# Altium schematic sheet CPU.SchDoc
size A4; SheetNumber: 4; SheetTotal: 5; SPICEModelCacheQSXZYONQ: <root> / <DocumentId>QSXZYONQ</DocumentId> / <CacheFrame Number="0"> / <Model Name="1n4148" Kind="MDL"> / <Text>.model 1N4148  D(Is=0.1p Rs=16 CJO=2p Tt=12n Bv=100 Ibv=0.1p)</Text> / </Model> / </CacheFrame> / </root>
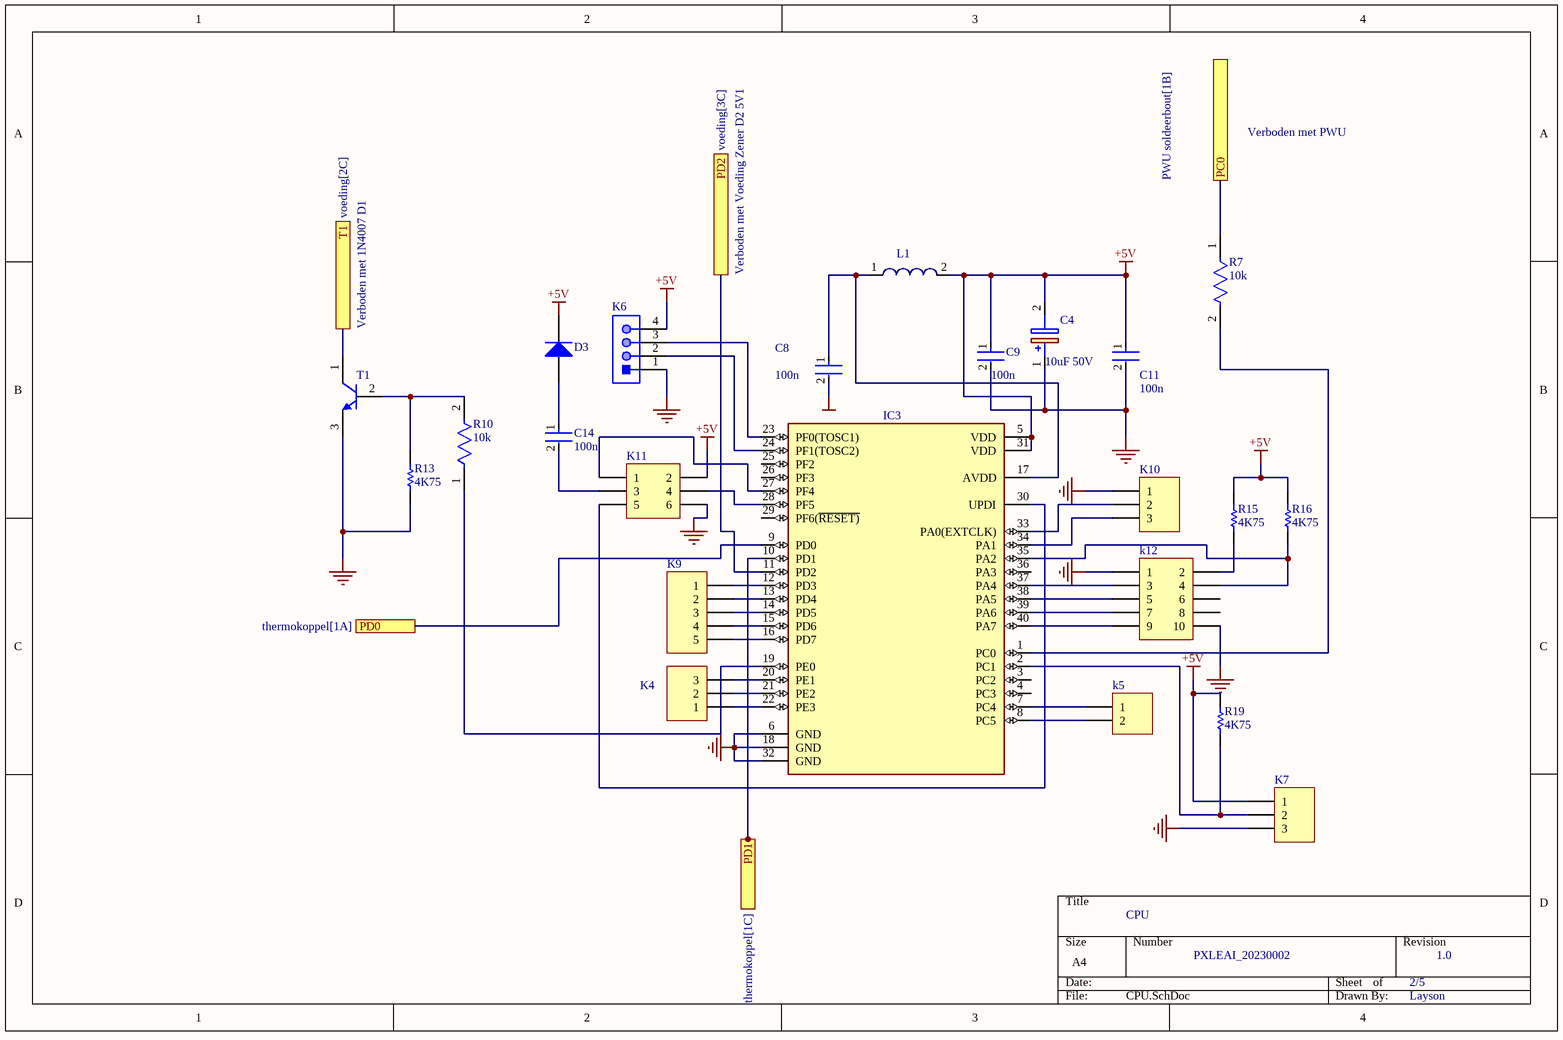
[diagram p0: CPU.SchDoc]

## Parts
C4  10uF 50V  [CAPPRD200W52D525H1200]
C8  100n  [FP-C0402-BB-MFG]
C9  100n  [FP-C0402-BB-MFG]
C11  100n  [FP-C0402-BB-MFG]
C14  100n  [FP-C0402-BB-MFG]
D3  Diode 1N4148  [DO-35]  (value not drawn)
IC3  ATMEGA4809-PF  [FP-C04-016-MFG]  (value not drawn)
K4  Header 3  [HDR1X3]  (value not drawn)
k5  Header 2  [HDR1X2]  (value not drawn)
K6  66200411122  [66200411122]  (value not drawn)
K7  Header 3  [HDR1X3]  (value not drawn)
K9  Header 5  [HDR1X5]  (value not drawn)
K10  Header 3  [HDR1X3]  (value not drawn)
K11  MHDR2X3  [MHDR2X3]  (value not drawn)
k12  Header 5X2  [HDR2X5]  (value not drawn)
L1  760308201  [3737]  (value not drawn)
R7  10k  [FP-MBB0207-MFG]
R10  10k  [FP-MBB0207-MFG]
R13  4K75  [RESA60-630X240]
R15  4K75  [RESA60-630X240]
R16  4K75  [RESA60-630X240]
R19  4K75  [RESA60-630X240]
T1  BC547CZL1G  [ONSC-TO-92-3-29-11_AM_BL]  (value not drawn)

## Ports
PC0 (see PWU soldeerbout[1B]), PD0 (see thermokoppel[1A]), PD1 (see thermokoppel[1C]), PD2 (see voeding[3C]), T1 (see voeding[2C])

## Nets
+5V: C4.2(-) C9.1 C11.1 D3.2(K) IC3.5(VDD) IC3.31(VDD) K6.4 K7.1 K11.2 L1.2 R15.2 R16.2 R19.2
GND: C4.1(+) C8.2 C9.2 C11.2 IC3.6(GND) IC3.18(GND) IC3.32(GND) K6.1 K7.3 K10.1 K11.6 k12.1 k12.10 R13.1 T1.3(E)
PC0: R7.1 ; port PC0
PD0: IC3.9(PD0) ; port PD0
PD1: IC3.10(PD1) ; port PD1
PD2: IC3.11(PD2) ; port PD2
T1: T1.1(C) ; port T1
NetC8_1: C8.1 IC3.17(AVDD) L1.1
NetC14_1: C14.1 D3.1(A)
NetC14_2: C14.2 K11.3
NetIC3_1: IC3.1(PC0) R7.2
NetIC3_2: IC3.2(PC1) K7.2 R19.1
NetIC3_7: IC3.7(PC4) k5.1
NetIC3_8: IC3.8(PC5) k5.2
NetIC3_12: IC3.12(PD3) K9.1
NetIC3_13: IC3.13(PD4) K9.2
NetIC3_14: IC3.14(PD5) K9.3
NetIC3_15: IC3.15(PD6) K9.4
NetIC3_16: IC3.16(PD7) K9.5
NetIC3_19: IC3.19(PE0) R10.1
NetIC3_20: IC3.20(PE1) K4.3
NetIC3_21: IC3.21(PE2) K4.2
NetIC3_22: IC3.22(PE3) K4.1
NetIC3_23: IC3.23(PF0(TOSC1)) K6.3
NetIC3_24: IC3.24(PF1(TOSC2)) K6.2
NetIC3_27: IC3.27(PF4) K11.1
NetIC3_28: IC3.28(PF5) K11.4
NetIC3_30: IC3.30(UPDI) K11.5
NetIC3_33: IC3.33(PA0(EXTCLK)) K10.2
NetIC3_34: IC3.34(PA1) K10.3
NetIC3_35: IC3.35(PA2) k12.4 R16.1
NetIC3_37: IC3.37(PA4) k12.3
NetIC3_38: IC3.38(PA5) k12.5
NetIC3_39: IC3.39(PA6) k12.7
NetIC3_40: IC3.40(PA7) k12.9
Netk12_2: k12.2 R15.1
NetR10_2: R10.2 R13.2 T1.2(B)

Not connected (* = marked no-connect by the designer): IC3 3(PC2) 4(PC3) 25(PF2) 26(PF3) 29(PF6(~{RESET)}) 36(PA3); k12 6 8

## Notes on the sheet
- Verboden met PWU
- Verboden met Voeding Zener D2 5V1
- Verboden met 1N4007 D1
- CPU
- PXLEAI_20230002
- 2/5
- 1.0
- Layson

## Library data of the parts
C4 = MCGPR50V106M5X11: Capacitor Polarised / MCGPR50V106M5X11; Manufacturer_Name: MULTICOMP; Datasheet Link: https://www.farnell.com/datasheets/2861351.pdf; Height: 12mm; Manufacturer_Part_Number: MCGPR50V106M5X11
C8 C9 C11 C14 = CMP-2008-02046-2: CAP CER 0.1UF 10V X5R 0402; Manufacturer: Kemet; Manufacturer Part Number: C0402C104K8PACTU; Material: Ceramic; Capacitance: 0.10 μF; Temperature Coefficient: 15%; Tolerance: 0.1; Value: 0.10 μF; Package: C0402-BB; Temperature: -55°C to +125°C; ComponentLink2Description: Datasheet; Temperature Characteristic: X5R; Device Class L1: Passive Components; Height: 0.55mm; Lead Free: Yes; ComponentLink2URL: https://content.kemet.com/datasheets/KEM_C1002_X7R_SMD.pdf; Device Class L2: Capacitors; Temperature Range Low: -55°C; Temperature Range High: +125°C; RoHS: TRUE; Octopart: https://octopart.com/c0402c104k8pactu-kemet-140039; Automotive: No; Mouser Description: Capacitor 100 nF 10 VDC 0402; Category: Cap; Voltage Rating: 10 V; Digikey Description: CAP CER 0.1UF 10V X5R 0402; Ipc Land Pattern Name: CAPC10050X50; Device Class L3: Ceramic Capacitors
D3 = Diode 1N4148: High Conductance Fast Diode; Published: 8-Jun-2000; LatestRevisionDate: 17-Jul-2002; LatestRevisionNote: Re-released for DXP Platform.; DatasheetVersion: 1997; PackageReference: DO-35; Publisher: Altium Limited; PackageDescription: Diode, Axial; Body 3.8 x 1.9 mm (LxDia. max), Lead Dia. 0.53 mm (max); Code_JEDEC: DO-204-AH; ComponentLink1Description: Manufacturer Link; ComponentLink1URL: http://www.fairchildsemi.com/; ComponentLink2Description: Datasheet; ComponentLink2URL: http://www.fairchildsemi.com/ds/1N%2F1N4148.pdf
IC3 = CMP-06276-000616-1: IC MCU 8BIT 48KB FLASH 40DIP; RoHS Compliant: Yes
K4 K7 K10 = Header 3: Header, 3-Pin; LatestRevisionDate: 17-Jul-2002; LatestRevisionNote: Re-released for DXP Platform.; Publisher: Altium Limited
k5 = Header 2: Header, 2-Pin; LatestRevisionDate: 17-Jul-2002; LatestRevisionNote: Re-released for DXP Platform.; Publisher: Altium Limited
K6 = CMP-1502-00442-1: THT Male Header WR-MPC3, Vertical, Single Row, pitch 3 mm, 4 pins; Manufacturer: Wurth Elektronik; Contact Resistance: 10mOhm; Working Voltage: 250VAC; Pin Number: 4; Pitch: 3mm; Manufacturer URL: http://www.we-online.de; Package Reference: 66200411122; Packaging: Tube; Part Number: 66200411122; Publisher: WurthElektronik; Orientation: Vertical; Mounting Technology: THT; Gender: Male; Operating Temperature: -40to105degC; Datasheet URL: https://katalog.we-online.de/em/datasheet/6620xx11122.pdf
K9 = Header 5: Header, 5-Pin; LatestRevisionDate: 17-Jul-2002; LatestRevisionNote: Re-released for DXP Platform.; Publisher: Altium Limited
K11 = MHDR2X3: Header, 3-Pin, Dual row; LatestRevisionDate: 17-Jul-2002; LatestRevisionNote: Re-released for DXP Platform.; Publisher: Altium Limited
k12 = Header 5X2: Header, 5-Pin, Dual row; LatestRevisionDate: 17-Jul-2002; LatestRevisionNote: Re-released for DXP Platform.; Publisher: Altium Limited
L1 = CMP-1432-00001-1: Wireless Power Charging Coil  WE-WPCC, L=10.0 µH; Manufacturer: Wuerth Elektronik; Inductance: 10.0 ÂµH; PackageReference: 3737; ComponentLink1URL: http://www.we-online.com; ComponentLink2Description: Datasheet; PartNumber: 760308201; ComponentLink2URL: http://katalog.we-online.de/kataloge/eisos/media/pdf/760308201.pdf; ComponentLink1Description: Manufacturer URL
R7 R10 = CMP-02408-000035-1: RES 10K OHM 0.6W 1% AXIAL; Voltage Rating: 300V; Resistance: 10kR; Max Power Dissipation: 600mW; Temperature Coefficient: 50ppm/°C; Radiation Hardening: No; Case/Package: Conformal; Termination: Axial; Military Standard: Not; Length: 6.5mm; Voltage Rating (DC): 300V; RoHS Compliant: Yes; Number of Terminations: 2; Packaging: Tape and Reel; Features: Automotive AEC-Q200; Tolerance: 1%; Min Operating Temperature: -55°C; Power Rating: 600mW; Lead Free: Lead Free; Resistor Type: Metal Film; Construction: Cylindrical; Series: MBB 0207 - Professional; Max Operating Temperature: 155°C; Diameter: 2.5mm; Resistance Tolerance: 1%; Contact Plating: Tin; Technology: THIN FILM
R13 R15 R16 R19 = CMP-1659-00066-1: Axial Resistor, 4.75 KOhm, +/- 1%, 0.25 W, -55 to 155 degC, 2-Pin THD, RoHS, Bulk; Case\Package: 1210; Voltage Rating (DC): 25 V; Type (Capacitors): X7R; Capacitance: 22 uF; Tolerance: 10%; PackageReference: MFR-25; DatasheetVersion: Apr-13; PackageDescription: 2-Pin Axial Lead, Dia 2.4 mm, Body Length 6.3 mm; ComponentLink1URL: http://www.yageo.com/; Radiation Hardening: No; Mount: Surface Mount; Height: 2.5 mm; Pins: 2; Package Quantity: 1000; REACH SVHC: No SVHC; Case Code (Imperial): 1210; Packaging: Tape and Reel; Max Operating Temperature: 125 degC; Case Code (Metric): 3225; ComponentLink1Description: Manufacturer URL; Min Operating Temperature: -55 degC; ComponentLink2Description: Datasheet; Voltage Rating: 25 V; Length: 3.2 mm; ComponentLink2URL: http://www.yageo.com/documents/recent/Yageo%20LR_MFR_2013.pdf; RoHSCompliant: true; Width: 2.5 mm
T1 = CMP-1048-01606-1: Amplifier Transistor, NPN Silicon, 3-Pin TO-92, Pb-Free, Ammo Box; Manufacturer: On Semiconductor; IC Continuous (A): 0.1; fT Min (MHz): 150; PackageDescription: 3-Pin Transistor Outline, Body 4.825 x 3.685 mm, Pitch 1.27 mm; ComponentLink2Description: Datasheet; PackageVersion: Rev. AM; DatasheetVersion: Rev. 7; Packing: Ammo Box; Mounting Technology: Through Hole; Polarity: NPN; ComponentLink3Description: Package Specification; PartNumber: BC547CZL1G; ComponentLink1Description: Manufacturer URL; PackageReference: TO-92-3-29-11_AM_BL; ComponentLink1URL: http://www.onsemi.com/; RoHS: TRUE; ComponentLink3URL: http://www.onsemi.com/pub_link/Collateral/MAC97-D.PDF; ComponentLink2URL: http://www.onsemi.com/pub_link/Collateral/BC546-D.PDF